# EAGLE design Qwiic_pHat_for_Raspberry_Pi_v30 (EAGLE 9.4.2)
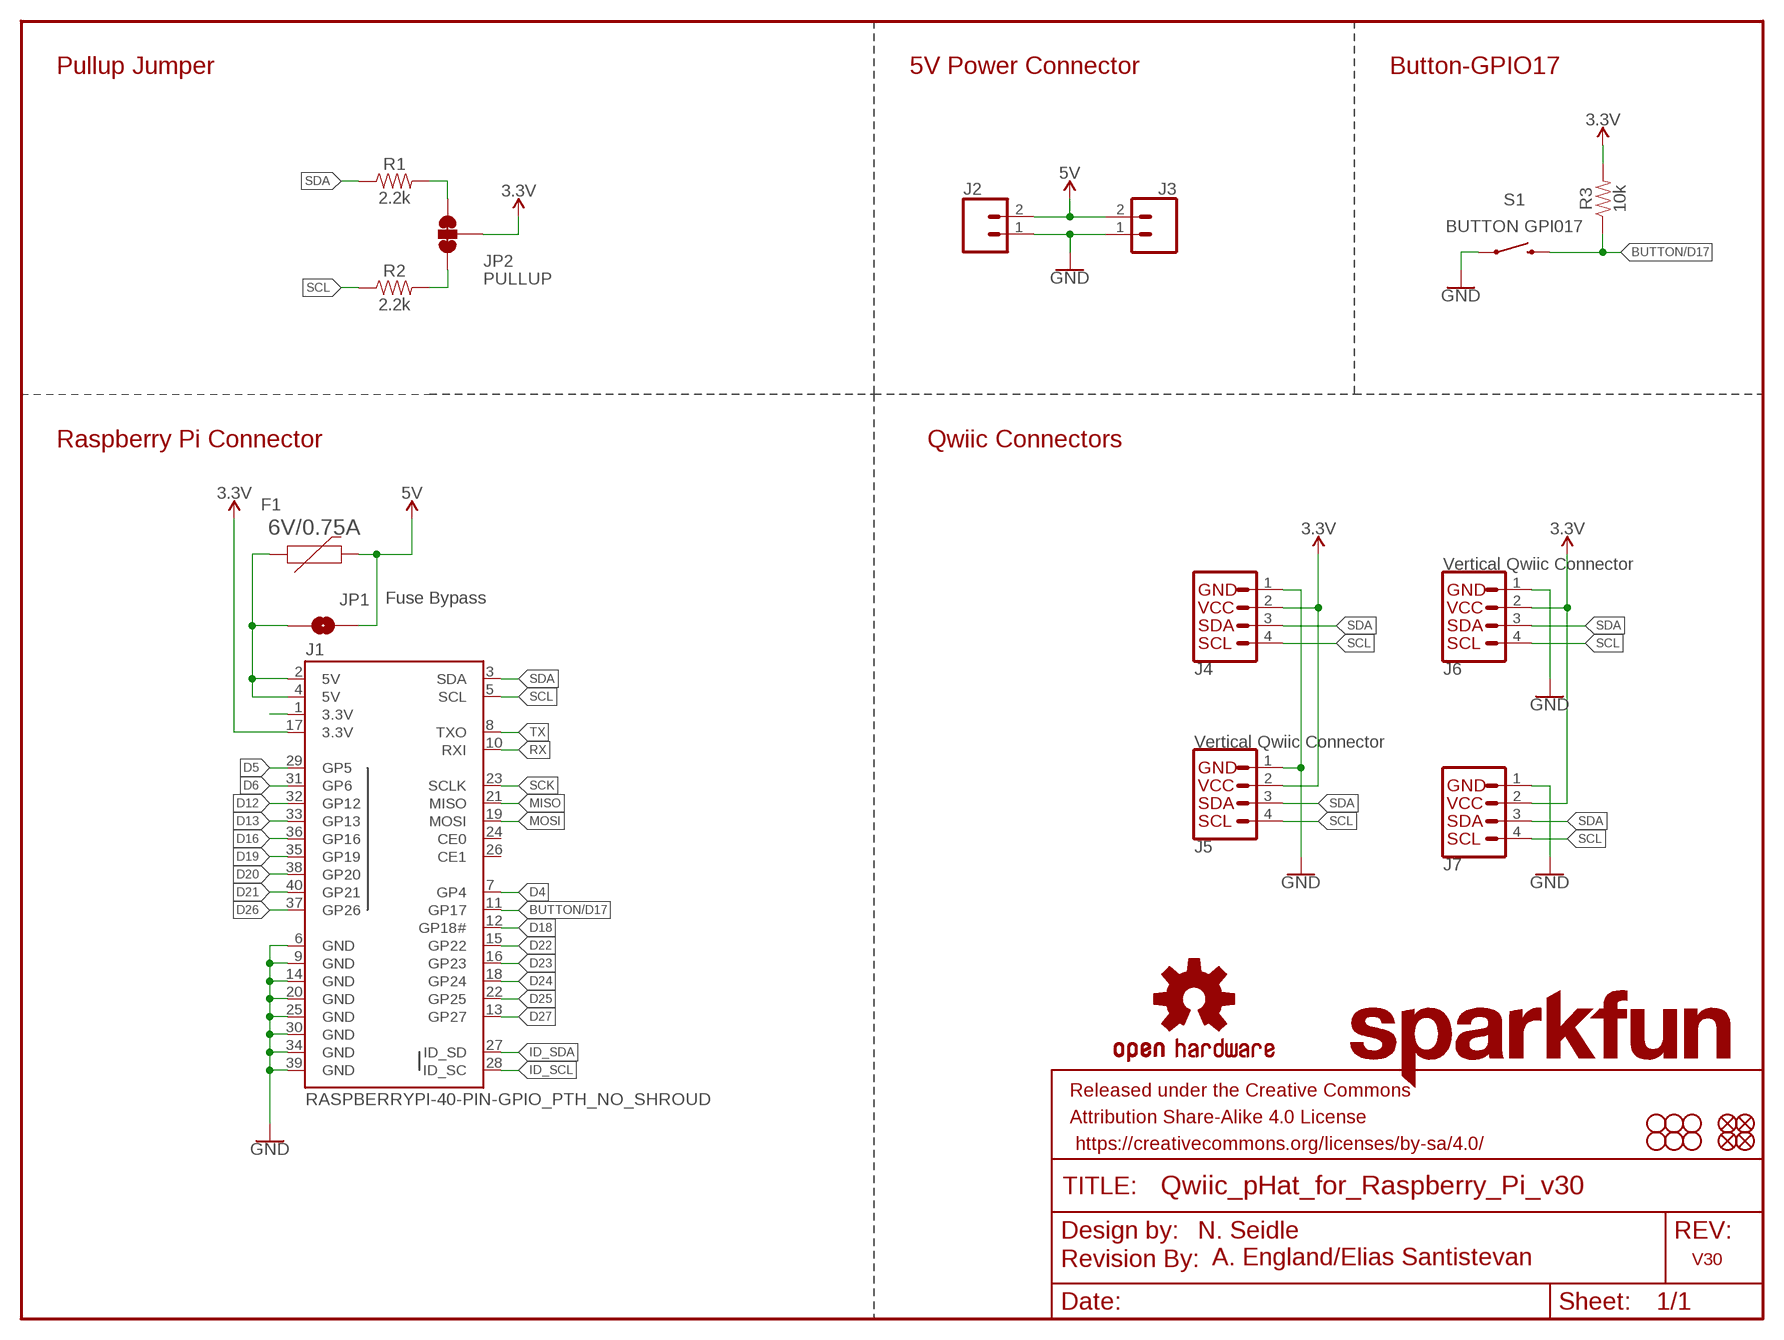
[diagram p0: schematic, sheet 1]

## Parts
F1  6V/0.75A  PPTC_0.75A  [1206]
FD1  FIDUCIAL1X2  [FIDUCIAL-1X2]
FD2  FIDUCIAL1X2  [FIDUCIAL-1X2]
FD3  FIDUCIAL1X2  [FIDUCIAL-1X2]
FD4  FIDUCIAL1X2  [FIDUCIAL-1X2]
FRAME1  FRAME-LETTER  [CREATIVE_COMMONS]
H1  STAND-OFFTIGHT  [STAND-OFF-TIGHT]
H2  STAND-OFFTIGHT  [STAND-OFF-TIGHT]
H3  STAND-OFFTIGHT  [STAND-OFF-TIGHT]
H4  STAND-OFFTIGHT  [STAND-OFF-TIGHT]
H5  STAND-OFFTIGHT  [STAND-OFF-TIGHT]
H6  STAND-OFFTIGHT  [STAND-OFF-TIGHT]
J1  RASPBERRYPI-40-PIN-GPIO_PTH_NO_SHROUD  [2X20]
J2  CONN_023.5MM-NO_SILK  [SCREWTERMINAL-3.5MM-2-NS]
J3  CONN_023.5MM  [SCREWTERMINAL-3.5MM-2]
J4  Qwiic Right Angle  I2C_STANDARDQWIIC  [JST04_1MM_RA]
J5  Vertical Qwiic Connector  QWIIC_CONNECTOR  [JST04_1MM_VERT]
J6  Vertical Qwiic Connector  QWIIC_CONNECTOR  [JST04_1MM_VERT]
J7  Qwiic Right Angle  I2C_STANDARDQWIIC  [JST04_1MM_RA]
JP1  JUMPER-SMT_2_NO_SILK  [SMT-JUMPER_2_NO_SILK]
JP2  PULLUP  JUMPER-SMT_3_2-NC_TRACE_NO-SILK  [SMT-JUMPER_3_2-NC_TRACE_NO-SILK]
LOGO1  REVISION  [REVISION]
LOGO2  OSHW-LOGOS  [OSHW-LOGO-S]
LOGO3  SFE_LOGO_NAME.1_INCH  [SFE_LOGO_NAME_.1]
R1  2.2k  2.2KOHM-0603-1/10W-1%  [0603]
R2  2.2k  2.2KOHM-0603-1/10W-1%  [0603]
R3  10k  10KOHM-0603-1/10W-1%  [0603]
S1  BUTTON GPI017  MOMENTARY-SWITCH-SPST-SMD-5.2MM-TALL  [TACTILE_SWITCH_SMD_5.2MM]

## Nets
3.3V: J1.17(3.3V) J4.2 J5.2 J6.2 J7.2 JP2.2 R3.2
5V: F1.2 J2.2 J3.2 JP1.2
BUTTON/D17: J1.11(GP17) R3.1 S1.3
D4: J1.7(GP4)
D5: J1.29(GP5)
D6: J1.31(GP6)
D12: J1.32(GP12)
D13: J1.33(GP13)
D16: J1.36(GP16)
D18: J1.12(GP18#)
D19: J1.35(GP19)
D20: J1.38(GP20)
D21: J1.40(GP21)
D22: J1.15(GP22)
D23: J1.16(GP23)
D24: J1.18(GP24)
D25: J1.22(GP25)
D26: J1.37(GP26)
D27: J1.13(GP27)
GND [vcc]: J1.6(GND) J1.9(GND) J1.14(GND) J1.20(GND) J1.25(GND) J1.30(GND) J1.34(GND) J1.39(GND) J2.1 J3.1 J4.1 J5.1 J6.1 J7.1 S1.1
ID_SCL: J1.28(ID_SC)
ID_SDA: J1.27(ID_SD)
MISO: J1.21(MISO)
MOSI: J1.19(MOSI)
N$1: J1.1(3.3V)
N$2: F1.1 J1.2(5V) J1.4(5V) JP1.1
N$3: JP2.3 R1.2
N$4: JP2.1 R2.2
RX: J1.10(RXI)
SCK: J1.23(SCLK)
SCL: J1.5(SCL) J4.4 J5.4 J6.4 J7.4 R2.1
SDA: J1.3(SDA) J4.3 J5.3 J6.3 J7.3 R1.1
TX: J1.8(TXO)
Unconnected: J1.24(CE0) J1.26(CE1)

## Notes on the sheet
- Pullup Jumper | 5V Power Connector | Button-GPIO17
- Raspberry Pi Connector | Qwiic Connectors
- Fuse Bypass
- N. Seidle
- A. England/Elias Santistevan | V30

## Library data of the parts
F1 = SparkFun-Fuses:PPTC: Resettable Fuse PPTC Resettable Fuse. Really a sort of resistor with a polymeric positive temperature coefficient whose resistance increases dramatically with an increase in temperature. When heated by the power passing through the resistance rises causing the current to be limited, protecting the circuit. This is achieved by the transition of the polymer from a crystalline to an amorphous state where the conductive carbon separates breaking the conductive pathways found in the cool crystalline structure. When a PPTC cools back down it resumes conducting letting the circuit turn back on. SparkFun Products: SparkFun RedBoard - Programmed with Arduino <https://www.sparkfun.com/products/12757> Pro Micro - 5V/16MHz <https://www.sparkfun.com/products/12640> Arduino Pro 328 - 5V/16MHz <https://www.sparkfun.com/products/10915> MP3 Trigger <https://www.sparkfun.com/products/13720>; PROD_ID: RES-11150
FD1-FD4 = SparkFun-Aesthetics:FIDUCIAL: Fiducial Alignment Points Point-of-reference for pick-and-place machines and other optical instruments.
FRAME1 = SparkFun-Aesthetics:FRAME-LETTER: Schematic Frame - Letter Standard 8.5x11 US Letter frame
H1-H6 = SparkFun-Hardware:STAND-OFF: Stand Off Drill holes for mechanically mounting via screws, standoffs, etc. Note: Use the keepout ring to avoid running the screw head into surrounding components. Variant Overviews STAND-OFF - Mechanical footprint for a #4 phillips button head screw. STAND-OFF-TIGHT - Mechanical footprint for a #4 phillips button head screw, Example SparkFun Products Screw - Phillips Head (1/4", 4-40, 10 pack) <https://www.sparkfun.com/products/10453> (PRT-10453) Screw - Phillips Head (1/2", 4-40, 10 pack) <https://www.sparkfun.com/products/10452> (PRT-10452) Screw - Phillips Head (3/4", 4-40, 10 pack) <https://www.sparkfun.com/products/10451> (PRT-10451) Screw - Phillips Head (1", 4-40, 10 pack) <https://www.sparkfun.com/products/10450> (PRT-10450)
J1 = SparkFun-Connectors:RASPBERRYPI-40-PIN-GPIO: Raspberry Pi GPIO Header 2x20 pin connector, as found on B, B+, A+ models. Both shrouded PTH and SMT versions available. SparkFun Products: GPIO Shrouded Header <https://www.sparkfun.com/products/13054>- PTH SparkFun Pi Wedge (Preassembled) <https://www.sparkfun.com/products/13717>
J2 J3 = SparkFun-Connectors:CONN_02: Multi connection point. Often used as Generic Header-pin footprint for 0.1 inch spaced/style header connections On any of the 0.1 inch spaced packages, you can populate with these: Break Away Headers - Straight <https://www.sparkfun.com/products/116> (PRT-00116) Break Away Male Headers - Right Angle <https://www.sparkfun.com/products/553> (PRT-00553) Female Headers <https://www.sparkfun.com/products/115> (PRT-00115) Break Away Headers - Machine Pin <https://www.sparkfun.com/products/117> (PRT-00117) Break Away Female Headers - Swiss Machine Pin <https://www.sparkfun.com/products/743> (PRT-00743) For SCREWTERMINALS and SPRING TERMINALS visit here: Screw Terimnals on SparkFun.com <https://www.sparkfun.com/search/results?term=Screw+Terminals> (5mm/3.5mm/2.54mm spacing) This device is also useful as a general connection point to wire up your design to another part of your project. Our various solder wires solder well into these plated through hole pads. Hook-Up Wire - Assortment (Stranded, 22 AWG) <https://www.sparkfun.com/products/11375> (PRT-11375) Hook-Up Wire - Assortment (Solid Core, 22 AWG) <https://www.sparkfun.com/products/11367> (PRT-11367) View the entire wire category on our website here <https://www.sparkfun.com/categories/141> Special notes: Molex polarized connector foot print use with: PRT-08233 with associated crimp pins and housings. 2.54_SCREWTERM for use with PRT-10571. 3.5mm Screw Terminal footprints for PRT-08084 5mm Screw Terminal footprints for use with PRT-08432; PROD_ID: CONN-08399
J4 J7 = SparkFun-Connectors:I2C_STANDARD: SparkFun I2C Standard Pinout Header SparkFun has standardized on a pinout for all I2C based sensor breakouts. This pinout allows I2C boards to be plugged directly into the headers on Arduino Uno compatible boards, and to be daisy chained easily. Example SparkFun Products: SparkFun Atmospheric Sensor Breakout - BME280 <https://www.sparkfun.com/products/13676> SparkFun Altitude/Pressure Sensor Breakout - MPL3115A2 <https://www.sparkfun.com/products/11084> SparkFun TOF Range Finder Sensor - VL6180 <https://www.sparkfun.com/products/12785>; PROD_ID: CONN-13694
J5 J6 = SparkFun-Connectors:QWIIC_CONNECTOR: SparkFun I2C Standard Qwiic Connector An SMD 1mm pitch JST connector makes it easy and quick (get it? Qwiic?) to connect I2C devices to each other. The Qwiic system <http://www.sparkfun.com/qwiic> enables fast and solderless connection between popular platforms and various sensors and actuators. We carry 200mm <https://www.sparkfun.com/products/14204>, 100mm <https://www.sparkfun.com/products/14205>, 50mm <https://www.sparkfun.com/products/14206>, and breadboard friendly <https://www.sparkfun.com/products/14207> Qwiic cables. We also offer 10 pcs strips <https://www.sparkfun.com/products/14323> the SMD connectors.; PROD_ID: CONN-14483
JP1 = SparkFun-Jumpers:JUMPER-SMT_2_NO: Normally open jumper This jumper has two pads in close proximity to each other. Apply solder to close the connection. Round pads are easier to solder for beginners, but are a lot larger. SparkFun Product that uses the round pads: SparkFun EL Sequencer <https://www.sparkfun.com/products/12781>
JP2 = SparkFun-Jumpers:JUMPER-SMT_3_2-NC_TRACE: Normally closed trace jumper (2 of 2 connections) This jumper has a trace between all three pads so they are normally closed (NC). Use a razor knife to open the connection(s). For best results follow the IPC guidelines for cutting traces: Cutout at least 0.063 mm (0.005 in). Remove all loose material to clean up the cut area. Seal the cut with an approved epoxy. Reapply solder to reclose the connection(s).
LOGO1 = SparkFun-Aesthetics:REVISION: "Revision By" Text Preceding text for revisor documentation. Includes schematic text on "symbols" layer, and board text on tDoc.
LOGO2 = SparkFun-Aesthetics:OSHW-LOGO: Open-Source Hardware (OSHW) Logo This logo indicates the piece of hardware it is found on incorporates a OSHW license and/or adheres to the definition of open source hardware found here: http://freedomdefined.org/OSHW
LOGO3 = SparkFun-Aesthetics:SFE_LOGO_NAME: SparkFun Font Logo This is the SparkFun name logo. The logo on the schematic will always be the same size; the package variant is the height of the flame part of the logo (or the height the flame would be, if it were drawn). Default layer for the logo on the board is tSilk.
R1 R2 = SparkFun-Resistors:2.2KOHM: 2.2kΩ resistor A resistor is a passive two-terminal electrical component that implements electrical resistance as a circuit element. Resistors act to reduce current flow, and, at the same time, act to lower voltage levels within circuits. - Wikipedia; PROD_ID: RES-08272
R3 = SparkFun-Resistors:10KOHM: 10kΩ resistor A resistor is a passive two-terminal electrical component that implements electrical resistance as a circuit element. Resistors act to reduce current flow, and, at the same time, act to lower voltage levels within circuits. - Wikipedia; PROD_ID: RES-00824
S1 = SparkFun-Switches:MOMENTARY-SWITCH-SPST: Momentary Switch (Pushbutton) - SPST Normally-open (NO) SPST momentary switches (buttons, pushbuttons). Variants PTH-12MM - 12mm square, through-hole Momentary Pushbutton Switch - 12mm Square <https://www.sparkfun.com/products/9190> (COM-09190) PTH-6.0MM, PTH-6.0MM-KIT - 6.0mm square, through-hole Mini Pushbutton Switch <https://www.sparkfun.com/products/97> (COM-00097) KIT package intended for soldering kit's - only one side of pads' copper is exposed. PTH-RIGHT-ANGLE-KIT - Right-angle, through-hole Right Angle Tactile Button <https://www.sparkfun.com/products/10791> - Used on SparkFun BigTime Watch Kit <https://www.sparkfun.com/products/11734> SMD-12MM - 12mm square, surface-mount Tactile Button - SMD (12mm) <https://www.sparkfun.com/products/12993> (COM-12993) Used on SparkFun PicoBoard <https://www.sparkfun.com/products/11888> SMD-4.5MM - 4.5mm Square Trackball Switch Used on SparkFun Blackberry Trackballer Breakout <https://www.sparkfun.com/products/13169> SMD-4.6MMX2.8MM - 4.60mm x 2.80mm, surface mount Used on SparkFun SAMD21 Mini Breakout <https://www.sparkfun.com/products/13664> SMD-5.2MM, SMD-5.2-REDUNDANT - 5.2mm square, surface-mount Mini Pushbutton Switch - SMD <https://www.sparkfun.com/products/8720> (COM-08720) Used on Arduino Pro Mini <https://www.sparkfun.com/products/11114> REDUNDANT package connects both switch circuits together SMD-6.0X3.5MM - 6.0 x 3.5mm, surface mount Momentary Reset Switch SMD <https://www.sparkfun.com/products/8229> (COM-08229) SMD-6.2MM-TALL - 6.2mm square, surface mount Tactile Button - SMD (6mm) <https://www.sparkfun.com/products/12992> Used on SparkFun Digital Sandbox <https://www.sparkfun.com/products/12651> SMD-RIGHT-ANGLE - Right-angle, surface mount Used on SparkFun Block for Intel® Edison - Arduino <https://www.sparkfun.com/products/13036>; PROD_ID: SWCH-14139

## Net classes
0 Default: width 0.178 mm
1 vcc: width 0.178 mm

## Board
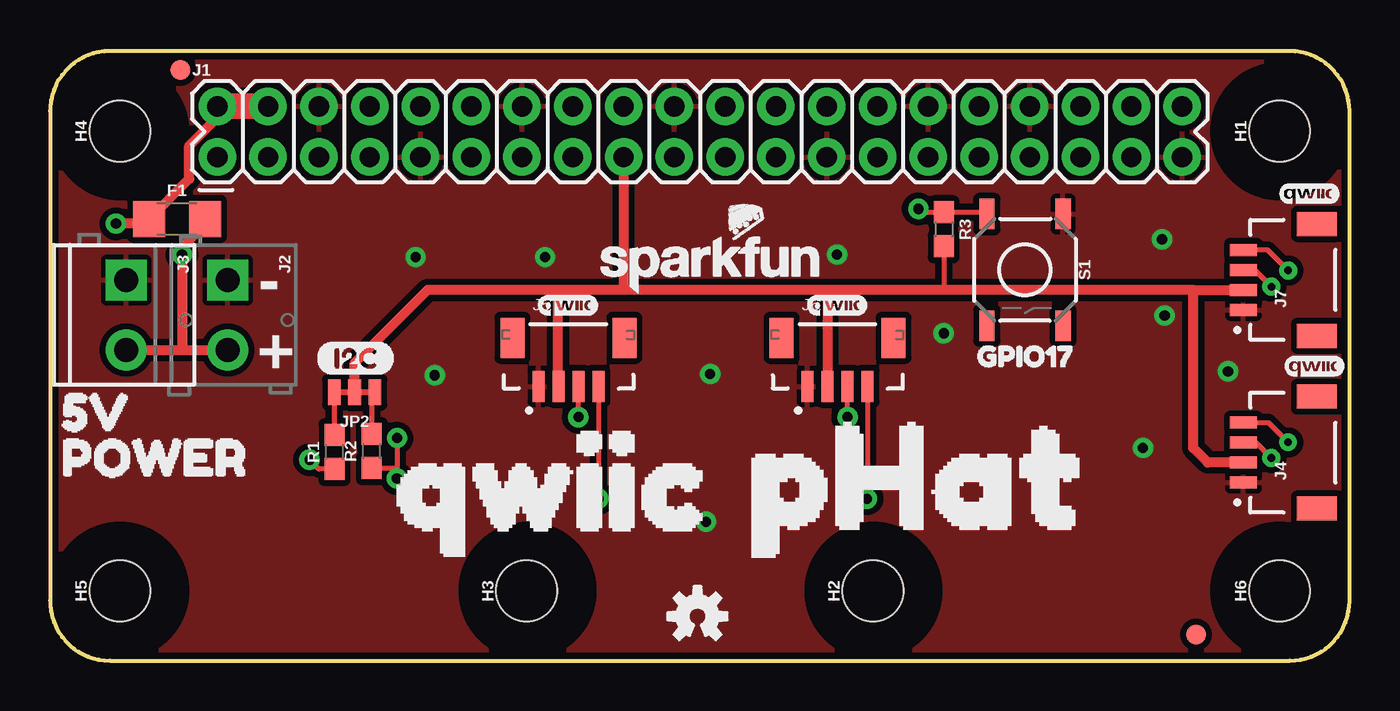
[diagram p1: board, top side]
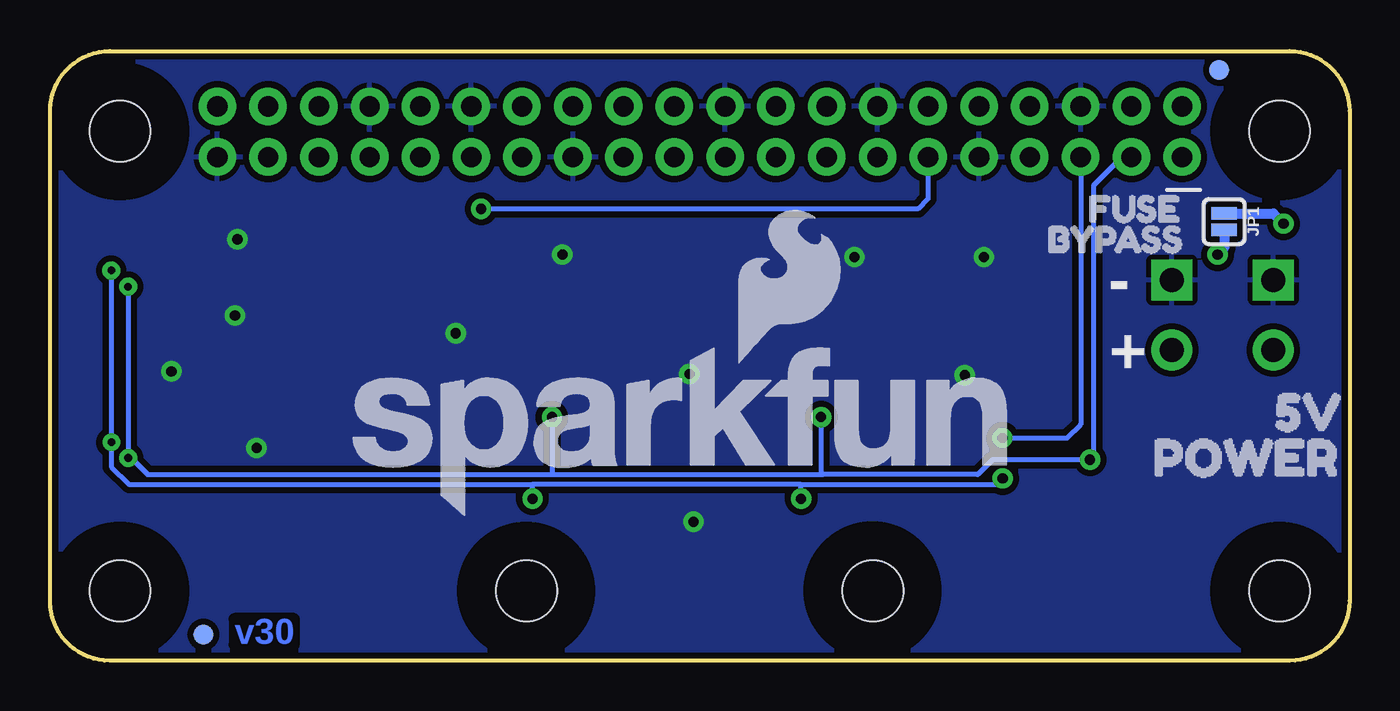
[diagram p2: board, bottom side, seen from below]

Size 65 x 30.5 mm. Coordinates in mm from the lower left corner, seen from the top.
Outline: 3,0 62,0 arc90 65,3 65,27.5 arc90 62,30.5 3,30.5 arc90 0,27.5 0,3 arc90 3,0
Copper layers (1*16): Top 0.035mm / dielectric 1.5mm / Bottom 0.035mm
Design rules "SparkFun-2-layer-STANDARD": minimum track width 10mil, minimum drill 20mil, track to track 10mil, track to pad 8mil, pad to pad 8mil, via to via 10mil, smd to smd 8mil, copper to edge 8mil, drill to drill 8mil, minimum pad ring 10mil, minimum via ring 10mil, stop-mask expansion 4mil, vias tented up to drill 25mil, thermal gap 10mil
tRestrict: area 0.4,0.4 to 6.7,6.7; area 58.4,0.4 to 64.7,6.7; area 58.4,23.4 to 64.7,29.6; area 0.4,23.4 to 6.7,29.6; area 38,0.3 to 44.3,6.6; area 20.7,0.4 to 27,6.7
bRestrict: area 58.4,0.4 to 64.7,6.7; area 0.4,0.4 to 6.7,6.7; area 0.4,23.4 to 6.7,29.6; area 58.4,23.4 to 64.7,29.6; area 38,0.3 to 44.3,6.6; area 20.7,0.4 to 27,6.7

### Footprints (pad centres in the part's own frame; a part is rotated, then mirrored left to right if it is on the bottom)
1206 = smd 1.6 x 1.8: 1 -1.4,0; 2 1.4,0
FIDUCIAL-1X2 = smd 1 x 1: 1 0,0
STAND-OFF-TIGHT = hole 3.048: 0,0
2X20 = drill 1.016 pad 1.88: 1 0,0; 2 0,2.54; 3 2.54,0; 4 2.54,2.54; 5 5.08,0; 6 5.08,2.54; 7 7.62,0; 8 7.62,2.54; 9 10.16,0; 10 10.16,2.54; 11 12.7,0; 12 12.7,2.54; 13 15.24,0; 14 15.24,2.54; 15 17.78,0; 16 17.78,2.54; 17 20.32,0; 18 20.32,2.54; 19 22.86,0; 20 22.86,2.54; 21 25.4,0; 22 25.4,2.54; 23 27.94,0; 24 27.94,2.54; 25 30.48,0; 26 30.48,2.54; 27 33.02,0; 28 33.02,2.54; 29 35.56,0; 30 35.56,2.54; 31 38.1,0; 32 38.1,2.54; 33 40.64,0; 34 40.64,2.54; 35 43.18,0; 36 43.18,2.54; 37 45.72,0; 38 45.72,2.54; 39 48.26,0; 40 48.26,2.54
SCREWTERMINAL-3.5MM-2-NS = drill 1.2 pad 2.032 square: 1 0,0 | drill 1.2 pad 2.032: 2 3.5,0
SCREWTERMINAL-3.5MM-2 = drill 1.2 pad 2.032 square: 1 0,0 | drill 1.2 pad 2.032: 2 3.5,0
JST04_1MM_RA = smd 0.6 x 1.35: 1 -1.5,0; 2 -0.5,0; 3 0.5,0; 4 1.5,0 | smd 1.2 x 2: NC1 2.8,-3.675; NC2 -2.8,-3.675
JST04_1MM_VERT = smd 0.6 x 1.55: 1 0.3,0.775; 2 1.3,0.775; 3 2.3,0.775; 4 3.3,0.775 | smd 1.2 x 2: NC1 -1,3.2; NC2 4.6,3.2
SMT-JUMPER_2_NO_SILK = smd 0.635 x 1.27: 1 -0.406,0; 2 0.406,0
SMT-JUMPER_3_2-NC_TRACE_NO-SILK = smd 0.635 x 1.27: 1 -1.016,0; 2 0,0; 3 1.016,0
0603 = smd 1.1 x 1: 1 -0.85,0; 2 0.85,0
TACTILE_SWITCH_SMD_5.2MM = smd 1.524 x 0.762: 1 -2.794,1.905; 2 2.794,1.905; 3 -2.794,-1.905; 4 2.794,-1.905

### Placement (x,y rotation side)
F1  6.35,22.1 0 top
FD1  6.52,29.56 180 top
FD2  57.33,1.31 180 top
FD3  57.33,1.31 0 bottom
FD4  6.52,29.56 0 bottom
FRAME1  -1.02,-21.84 0 top  (outside the outline)
H1  61.5,26.5 90 top
H2  41.15,3.5 90 top
H3  23.85,3.5 90 top
H4  3.5,26.5 90 top
H5  3.5,3.5 90 top
H6  61.5,3.5 90 top
J1  8.37,25.2 0 top
J2  8.89,19.05 270 top
J3  3.81,19.05 270 top
J4  59.69,10.41 90 top
J5  24.13,12.95 0 top
J6  37.59,12.95 0 top
J7  59.69,19.05 90 top
JP1  6.27,21.97 270 bottom
JP2  15.24,13.43 180 top
LOGO1  10.41,-24.38 0 top  (outside the outline)
LOGO2  32.39,2.22 0 top
LOGO3  33.02,19.81 0 top
R1  14.24,10.44 90 top
R2  16.1,10.49 90 top
R3  44.7,21.59 270 top
S1  48.77,19.56 270 top
U$1  [PIE_1F967#PNG]  34.8,22.1 20 top
U$2  [I2C-()]  13.26,15.14 0 top
U$3  [PHAT0]  30.29,9.24 0 top
U$6  [FUSE0]  14.22,22.61 0 bottom
U$7  [BYPASS1]  16.26,21.08 0 bottom
U$8  [QWIIC_3MM]  39.37,17.78 0 top
U$9  [GPIO173]  45.47,15.24 0 top
U$10  [SFE_LOGO_NAME_FLAME_.3]  33.53,11.43 0 bottom
U$11  [QWIIC_3MM]  62.99,23.37 0 top
U$12  [5V0]  -1.02,12.45 0 top
U$13  [POWER1]  -1.02,10.16 0 top
U$14  [POWER1]  11.43,10.16 0 bottom
U$15  [5V0]  5.33,12.45 0 bottom
U$16  [QWIIC_3MM]  63.25,14.73 0 top
U$17  [QWIIC_3MM]  25.91,17.78 0 top
U$18  [QWIIC0]  13.21,8.89 0 top

### Tracks (layer width: path | path; a pad name or v marks a point on that pad's centre or on a via)
3.3V
  Top 0.254: R3.2 44.7,18.55
  Top 0.508: J4.2 57.9,9.91 57.17,10.64 57.17,18.55 | 57.17,18.55 44.7,18.55 39.12,18.55 | 39.12,18.55 28.7,18.55 | 28.7,18.55 28.69,18.56 J1.17 | 28.7,18.55 25.4,18.55 | 25.4,18.55 18.89,18.55 15.24,14.9 JP2.2 | 57.17,18.55 J7.2 | 39.12,18.55 38.89,18.33 J6.2 | J5.2 25.4,13.76 25.4,18.55
5V  (via drill 0.51)
  Top 0.508: F1.2 7.75,21.85 6.6,20.7 v6.6,20.32 6.6,15.55 | J3.2 6.6,15.55 | 6.6,15.55 J2.2
  Bottom 0.508: JP1.2 6.27,20.65 v6.6,20.32
BUTTON/D17  (via drill 0.51)
  Top 0.254: S1.3 46.77,22.44 R3.1 43.6,22.44 v43.43,22.61
  Bottom 0.254: J1.11 21.08,25.19 21.08,23.11 21.59,22.61 v43.43,22.61
GND  (via drill 0.51)
  other vias: 55.63,21.08 58.93,14.48 55.75,17.27 18.29,20.19 24.77,20.19 33.02,14.35 44.7,16.38 39.37,20.32 19.24,14.28 32.81,6.95 54.67,10.64
  pour Top (isolate 0.305): 0,30.51 65.02,30.51 65.02,0 0,0
  pour Bottom (isolate 0.305): 0,30.51 65.02,30.51 65.02,0 0,0
N$2  (via drill 0.51)
  Top 0.508: J1.2 8.37,27.18 6.97,25.78 6.97,24.12 F1.1 4.72,21.87 v3.3,21.87
  Top 1.27: J1.2 J1.4
  Bottom 0.508: JP1.1 3.81,22.38 v3.3,21.87
N$3
  Top 0.254: R1.2 14.22,11.3 JP2.3
N$4
  Top 0.254: JP2.1 16.1,13.28 R2.2
SCL  (via drill 0.38, 0.51)
  Top 0.254: J4.4 60.94,11.91 v61.93,10.93 | v61.93,19.52 60.91,20.55 J7.4 | v27.43,8.1 v27.43,8.11 J5.4 | v17.35,9.12 v17.36,9.13 17.36,9.65 | v17.36,11.14 17.36,9.65 | R2.1 17.34,9.64 17.36,9.65 | J6.4 40.89,8.13 v40.87,8.1
  Bottom 0.254: v61.93,19.52 v61.93,10.93 61.93,9.71 61.03,8.81 40.89,8.81 | 27.43,8.81 17.65,8.81 v17.35,9.12 | v27.43,8.1 27.43,8.81 | 27.43,8.81 40.89,8.81 | v40.87,8.1 40.87,8.79 40.89,8.81 | J1.5 13.45,11.82 14.13,11.14 v17.36,11.14
SDA  (via drill 0.38, 0.51)
  Top 0.254: J4.3 60.32,10.91 v61.09,10.15 | v61.09,18.71 60.26,19.55 J7.3 | R1.1 13.45,9.59 v12.98,10.06 | v39.89,12.19 J6.3 | v26.43,12.19 J5.3
  Bottom 0.254: v61.09,18.71 v61.09,10.15 60.95,10.15 60.12,9.32 39.88,9.32 | 39.88,9.32 26.43,9.32 26.43,9.4 | 26.43,9.4 26.35,9.32 18.59,9.32 17.86,10.06 v12.98,10.06 12.79,10.25 12.79,23.79 11.38,25.2 J1.3 | v26.43,12.19 26.43,9.4 | v39.89,12.19 39.89,9.34 39.88,9.32

### Text on the board
Bottom: v30
tPlace: - | +
bPlace: - | +
Measures: Units in MM
tDocu: N. Seidle | A. England and Elias Santistevan